# EAGLE design SIM-RELAY-2 (EAGLE 9.6.1)
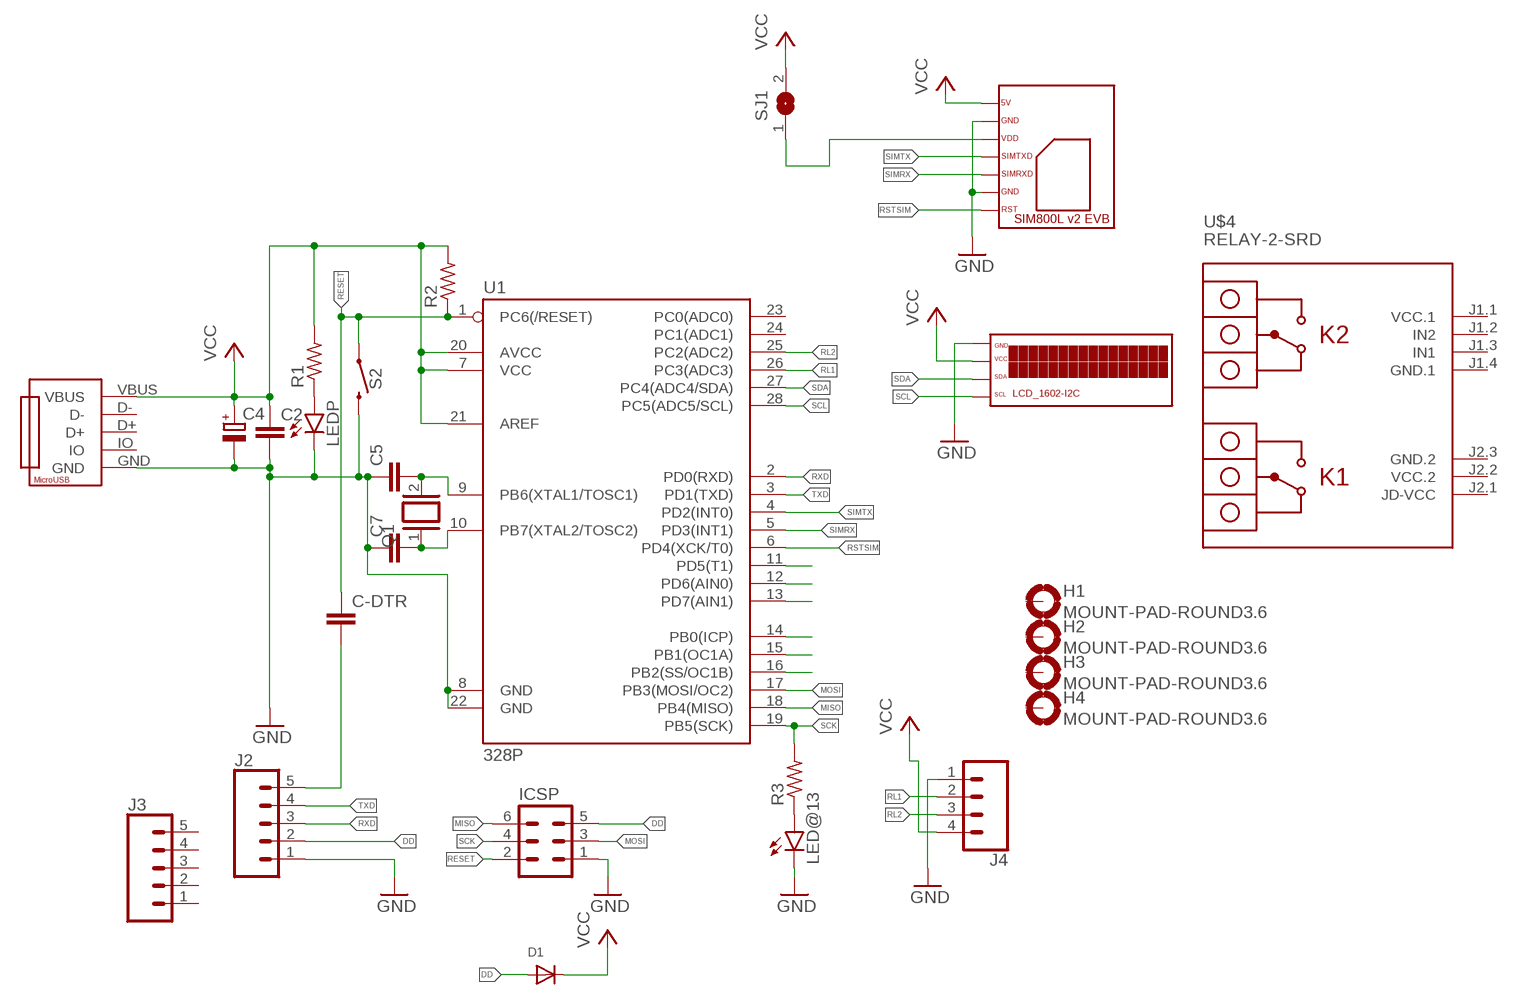
[diagram p0: schematic, sheet 1]

## Parts
C2  C-EU050-024X044  [C050-024X044]
C4  CPOL-EUB45181A  [B45181A]
C5  C-EU025-024X044  [C025-024X044]
C7  C-EU025-024X044  [C025-024X044]
C-DTR  C-EU050-024X044  [C050-024X044]
D1  DIODESMA  [SMADIODE]
H1  MOUNT-PAD-ROUND3.6  [3,6-PAD]
H2  MOUNT-PAD-ROUND3.6  [3,6-PAD]
H3  MOUNT-PAD-ROUND3.6  [3,6-PAD]
H4  MOUNT-PAD-ROUND3.6  [3,6-PAD]
ICSP  MA03-2  [MA03-2]
J2  CONN_05  [1X05]
J3  CONN_05  [1X05]
J4  CONN_04POLAR  [MOLEX-1X4]
LED@13  LED3MM  [LED3MM]
LEDP  LED3MM  [LED3MM]
Q1  XTAL/S  [QS]
R1  R-US_R0805  [R0805]
R2  R-US_R0805  [R0805]
R3  R-US_R0805  [R0805]
S2  MOMENTARY-SWITCH-SPST-SMD-6.0X3.5MM  [TACTILE_SWITCH_SMD_6.0X3.5MM]
SJ1  SJ  [SJ]
U1  328P  ATMEGA328P_PDIP  [DIP28]
U$1  LCD1602-I2C  [1602-I2C]
U$2  SIM800V2  [SIM800V2]
U$4  RELAY-2-SRD  [RELAY-2-SRD]
U$5  MICROUSB-CONVERTER  [MICROUSB-CONV-1]

## Nets
DD: D1.A ICSP.5 J2.2
GND [vcc]: C2.2 C4.- C5.1 C7.1 ICSP.1 J2.1 J4.1 LED@13.K(C) LEDP.K(C) S2.2 U1.8(GND) U1.22(GND) U$1.GND U$2.GND U$2.GND2 U$5.GND
MISO: ICSP.6 U1.18(PB4(MISO))
MOSI: ICSP.3 U1.17(PB3(MOSI/OC2))
N$1: LEDP.A R1.1
N$2: LED@13.A R3.1
N$3: C-DTR.2 J2.5
N$4: SJ1.1 U$2.VDD
N$8: U1.11(PD5(T1))
N$11: U1.12(PD6(AIN0))
N$12: U1.13(PD7(AIN1))
N$13: U1.14(PB0(ICP))
N$14: U1.15(PB1(OC1A))
N$15: U1.16(PB2(SS/OC1B))
N$21: C7.2 Q1.1 U1.10(PB7(XTAL2/TOSC2))
N$22: C5.2 Q1.2 U1.9(PB6(XTAL1/TOSC1))
RESET: C-DTR.1 ICSP.2 R2.1 S2.1 U1.1(PC6(/RESET))
RL1: J4.2 U1.26(PC3(ADC3))
RL2: J4.3 U1.25(PC2(ADC2))
RSTSIM: U1.6(PD4(XCK/T0)) U$2.RST
RXD: J2.3 U1.2(PD0(RXD))
SCK: ICSP.4 R3.2 U1.19(PB5(SCK))
SCL: U1.28(PC5(ADC5/SCL)) U$1.SCL
SDA: U1.27(PC4(ADC4/SDA)) U$1.SDA
SIMRX: U1.5(PD3(INT1)) U$2.SIMRXD
SIMTX: U1.4(PD2(INT0)) U$2.SIMTXD
TXD: J2.4 U1.3(PD1(TXD))
VCC: C2.1 C4.+ D1.C J4.4 R1.2 R2.2 SJ1.2 U1.7(VCC) U1.20(AVCC) U1.21(AREF) U$1.VCC U$2.5V U$5.VBUS
Unconnected: H1.B3,6(MOUNT) H2.B3,6(MOUNT) H3.B3,6(MOUNT) H4.B3,6(MOUNT) J3.1 J3.2 J3.3 J3.4 J3.5 U1.23(PC0(ADC0)) U1.24(PC1(ADC1)) U$4.J1.2(IN2) U$4.J1.3(IN1) U$4.J2.1(JD-VCC) U$5.D+ U$5.D- U$5.IO

## Power pins joined to a net without a drawn wire
GND.1: U$4.J1.4(GND.1)
GND.2: U$4.J2.3(GND.2)
VCC.1: U$4.J1.1(VCC.1)
VCC.2: U$4.J2.2(VCC.2)

## Library data of the parts
C2 C5 C7 C-DTR = rcl:C-EU: CAPACITOR, European symbol; SPICEPREFIX: C
C4 = rcl:CPOL-EU: POLARIZED CAPACITOR, European symbol; SPICEPREFIX: C
D1 = adafruit:DIODE: Diode SMADIODE - SMA Surface Mount Package 20V 1A Schottky Diode Digikey: 641-1014-6-ND DO-1N4148 - Through Hole Small Current Diode SOD-123 20V 1 A (.5mV Vf) Schottky Diode - Digikey: MBRX120TPMSCT-ND SOD-323 10V 570mA (.38mV Vf, 3ns) Schottky Diode - Digikey: ZLLS410CT-ND SOD-523 30V 30mA Schottky Diode (RB751S-40TE61) - Digikey: RB751S-40TE61CT-ND SOT23-R/W - SOT23 Package (R = Solder Paste/Reflow Ovens, W = Hand-Soldering) BAT54Film 40V 300mA - Digikey: 497-7162-1-ND
H1-H4 = holes:MOUNT-PAD-ROUND: MOUNTING PAD, round
ICSP = con-lstb:MA03-2: PIN HEADER; OC_FARNELL: unknown; OC_NEWARK: unknown
J2 J3 = SparkFun-Connectors:CONN_05: Multi connection point. Often used as Generic Header-pin footprint for 0.1 inch spaced/style header connections On any of the 0.1 inch spaced packages, you can populate with these: Break Away Headers - Straight <https://www.sparkfun.com/products/116> (PRT-00116) Break Away Male Headers - Right Angle <https://www.sparkfun.com/products/553> (PRT-00553) Female Headers <https://www.sparkfun.com/products/115> (PRT-00115) Break Away Headers - Machine Pin <https://www.sparkfun.com/products/117> (PRT-00117) Break Away Female Headers - Swiss Machine Pin <https://www.sparkfun.com/products/743> (PRT-00743) For SCREWTERMINALS and SPRING TERMINALS visit here: Screw Terimnals on SparkFun.com <https://www.sparkfun.com/search/results?term=Screw+Terminals> (5mm/3.5mm/2.54mm spacing) This device is also useful as a general connection point to wire up your design to another part of your project. Our various solder wires solder well into these plated through hole pads. Hook-Up Wire - Assortment (Stranded, 22 AWG) <https://www.sparkfun.com/products/11375> (PRT-11375) Hook-Up Wire - Assortment (Solid Core, 22 AWG) <https://www.sparkfun.com/products/11367> (PRT-11367) View the entire wire category on our website here <https://www.sparkfun.com/categories/141> Special notes: Molex polarized connector foot print use with SKU : PRT-08231 with associated crimp pins and housings. 1MM SMD Version SKU: PRT-10208
J4 = SparkFun-Connectors:CONN_04: Multi connection point. Often used as Generic Header-pin footprint for 0.1 inch spaced/style header connections On any of the 0.1 inch spaced packages, you can populate with these: Break Away Headers - Straight <https://www.sparkfun.com/products/116> (PRT-00116) Break Away Male Headers - Right Angle <https://www.sparkfun.com/products/553> (PRT-00553) Female Headers <https://www.sparkfun.com/products/115> (PRT-00115) Break Away Headers - Machine Pin <https://www.sparkfun.com/products/117> (PRT-00117) Break Away Female Headers - Swiss Machine Pin <https://www.sparkfun.com/products/743> (PRT-00743) For SCREWTERMINALS and SPRING TERMINALS visit here: Screw Terimnals on SparkFun.com <https://www.sparkfun.com/search/results?term=Screw+Terminals> (5mm/3.5mm/2.54mm spacing) This device is also useful as a general connection point to wire up your design to another part of your project. Our various solder wires solder well into these plated through hole pads. Hook-Up Wire - Assortment (Stranded, 22 AWG) <https://www.sparkfun.com/products/11375> (PRT-11375) Hook-Up Wire - Assortment (Solid Core, 22 AWG) <https://www.sparkfun.com/products/11367> (PRT-11367) View the entire wire category on our website here <https://www.sparkfun.com/categories/141> Special notes: Molex polarized connector foot print use with SKU : PRT-08231 with associated crimp pins and housings. 1MM SMD Version SKU: PRT-10208; PROD_ID: CONN-08186; SF_ID: PRT-08231
LED@13 LEDP = led:LED: LED OSRAM: - CHIPLED LG R971, LG N971, LY N971, LG Q971, LY Q971, LO R971, LY R971 LH N974, LH R974 LS Q976, LO Q976, LY Q976 LO Q996 - Hyper CHIPLED LW Q18S LB Q993, LB Q99A, LB R99A - SideLED LS A670, LO A670, LY A670, LG A670, LP A670 LB A673, LV A673, LT A673, LW A673 LH A674 LY A675 LS A676, LA A676, LO A676, LY A676, LW A676 LS A679, LY A679, LG A679 - Hyper Micro SIDELED® LS Y876, LA Y876, LO Y876, LY Y876 LT Y87S - SmartLED LW L88C, LW L88S LB L89C, LB L89S, LG L890 LS L89K, LO L89K, LY L89K LS L896, LA L896, LO L896, LY L896 - TOPLED LS T670, LO T670, LY T670, LG T670, LP T670 LSG T670, LSP T670, LSY T670, LOP T670, LYG T670 LG T671, LOG T671, LSG T671 LB T673, LV T673, LT T673, LW T673 LH T674 LS T676, LA T676, LO T676, LY T676, LB T676, LH T676, LSB T676, LW T676 LB T67C, LV T67C, LT T67C, LS T67K, LO T67K, LY T67K, LW E67C LS E67B, LA E67B, LO E67B, LY E67B, LB E67C, LV E67C, LT E67C LW T67C LS T679, LY T679, LG T679 LS T770, LO T770, LY T770, LG T770, LP T770 LB T773, LV T773, LT T773, LW T773 LH T774 LS E675, LA E675, LY E675, LS T675 LS T776, LA T776, LO T776, LY T776, LB T776 LHGB T686 LT T68C, LB T68C - Hyper Mini TOPLED® LB M676 - Mini TOPLED Santana® LG M470 LS M47K, LO M47K, LY M47K Source: http://www.osram.convergy.de LUXEON: - LUMILED® LXK2-PW12-R00, LXK2-PW12-S00, LXK2-PW14-U00, LXK2-PW14-V00 LXK2-PM12-R00, LXK2-PM12-S00, LXK2-PM14-U00 LXK2-PE12-Q00, LXK2-PE12-R00, LXK2-PE12-S00, LXK2-PE14-T00, LXK2-PE14-U00 LXK2-PB12-K00, LXK2-PB12-L00, LXK2-PB12-M00, LXK2-PB14-N00, LXK2-PB14-P00, LXK2-PB14-Q00 LXK2-PR12-L00, LXK2-PR12-M00, LXK2-PR14-Q00, LXK2-PR14-R00 LXK2-PD12-Q00, LXK2-PD12-R00, LXK2-PD12-S00 LXK2-PH12-R00, LXK2-PH12-S00 LXK2-PL12-P00, LXK2-PL12-Q00, LXK2-PL12-R00 Source: www.luxeon.com KINGBRIGHT: KA-3528ASYC Source: www.kingbright.com
Q1 = special:XTAL/S: CRYSTAL
R1-R3 = rcl:R-US_: RESISTOR, American symbol; SPICEPREFIX: R
S2 = SparkFun-Switches:MOMENTARY-SWITCH-SPST: Momentary Switch (Pushbutton) - SPST Normally-open (NO) SPST momentary switches (buttons, pushbuttons). Variants PTH-12MM - 12mm square, through-hole Momentary Pushbutton Switch - 12mm Square <https://www.sparkfun.com/products/9190> (COM-09190) PTH-6.0MM, PTH-6.0MM-KIT - 6.0mm square, through-hole Mini Pushbutton Switch <https://www.sparkfun.com/products/97> (COM-00097) KIT package intended for soldering kit's - only one side of pads' copper is exposed. PTH-RIGHT-ANGLE-KIT - Right-angle, through-hole Right Angle Tactile Button <https://www.sparkfun.com/products/10791> - Used on SparkFun BigTime Watch Kit <https://www.sparkfun.com/products/11734> SMD-12MM - 12mm square, surface-mount Tactile Button - SMD (12mm) <https://www.sparkfun.com/products/12993> (COM-12993) Used on SparkFun PicoBoard <https://www.sparkfun.com/products/11888> SMD-4.5MM - 4.5mm Square Trackball Switch Used on SparkFun Blackberry Trackballer Breakout <https://www.sparkfun.com/products/13169> SMD-4.6MMX2.8MM - 4.60mm x 2.80mm, surface mount Used on SparkFun SAMD21 Mini Breakout <https://www.sparkfun.com/products/13664> SMD-5.2MM, SMD-5.2-REDUNDANT - 5.2mm square, surface-mount Mini Pushbutton Switch - SMD <https://www.sparkfun.com/products/8720> (COM-08720) Used on Arduino Pro Mini <https://www.sparkfun.com/products/11114> REDUNDANT package connects both switch circuits together SMD-6.0X3.5MM - 6.0 x 3.5mm, surface mount Momentary Reset Switch SMD <https://www.sparkfun.com/products/8229> (COM-08229) SMD-6.2MM-TALL - 6.2mm square, surface mount Tactile Button - SMD (6mm) <https://www.sparkfun.com/products/12992> Used on SparkFun Digital Sandbox <https://www.sparkfun.com/products/12651> SMD-RIGHT-ANGLE - Right-angle, surface mount Used on SparkFun Block for Intel® Edison - Arduino <https://www.sparkfun.com/products/13036>; PROD_ID: SWCH-00815; SF_SKU: COM-08229
SJ1 = jumper:SJ: SMD solder JUMPER
U1 = SparkFun-IC-Microcontroller:ATMEGA328P_PDIP: Atmel 328P Through hole ATMEGA328P uC used in the Arduino 32kb flash, 1k EEPROM, 2k SRAM Datasheet <http://www.sparkfun.com/datasheets/Components/SMD/ATMega328.pdf> SparkFun Products Storefront component: AVR 28 Pin 20MHz 32K 6A/D - ATMega328P <https://www.sparkfun.com/products/9061> (COM-09061) SparkFun Simon Says - Through-Hole Soldering Kit <https://www.sparkfun.com/products/10547> (KIT-10547) SparkFun Learn to Solder - Simon Says <https://www.sparkfun.com/products/13708> (KIT-13708) SparkFun BigTime Watch Kit <https://www.sparkfun.com/products/11734> (KIT-11734) SparkFun ClockIt <https://www.sparkfun.com/products/10930> (KIT-10930) SparkFun Serial Enabled LCD Kit <https://www.sparkfun.com/products/10097> (LCD-10097) SparkFun Simon Tilts - Through Hole Soldering Kit <https://www.sparkfun.com/products/12634> (KIT-12634) SparkFun Frequency Counter Kit <https://www.sparkfun.com/products/10140> (KIT-10140) FabFM Radio Kit <https://www.sparkfun.com/products/11043> (KIT-11043) SparkFun Binary Blaster Kit <https://www.sparkfun.com/products/12037> (KIT-12037) SparkFun Metro-Gnome <https://www.sparkfun.com/products/9236> (KIT-09236) ATmega328 with Arduino Optiboot (Uno) <https://www.sparkfun.com/products/10524> (DEV-10524); PROD_ID: IC-09136
U$1 = IBe-9102-lib:LCD1602-I2C
U$2 = IBe-9102-lib:SIM800V2
U$4 = diy-modules:RELAY-2-SRD: 2-Channel Relay Module based on SRD-05VDC-SL-C relays Click here to find device on ebay.com <http://www.ebay.com/sch/two+channel+relay+module+optocoupler+5v>
U$5 = IBe-9102-lib:MICROUSB-CONVERTER

## Net classes
1 vcc: width 0.254 mm

## Board
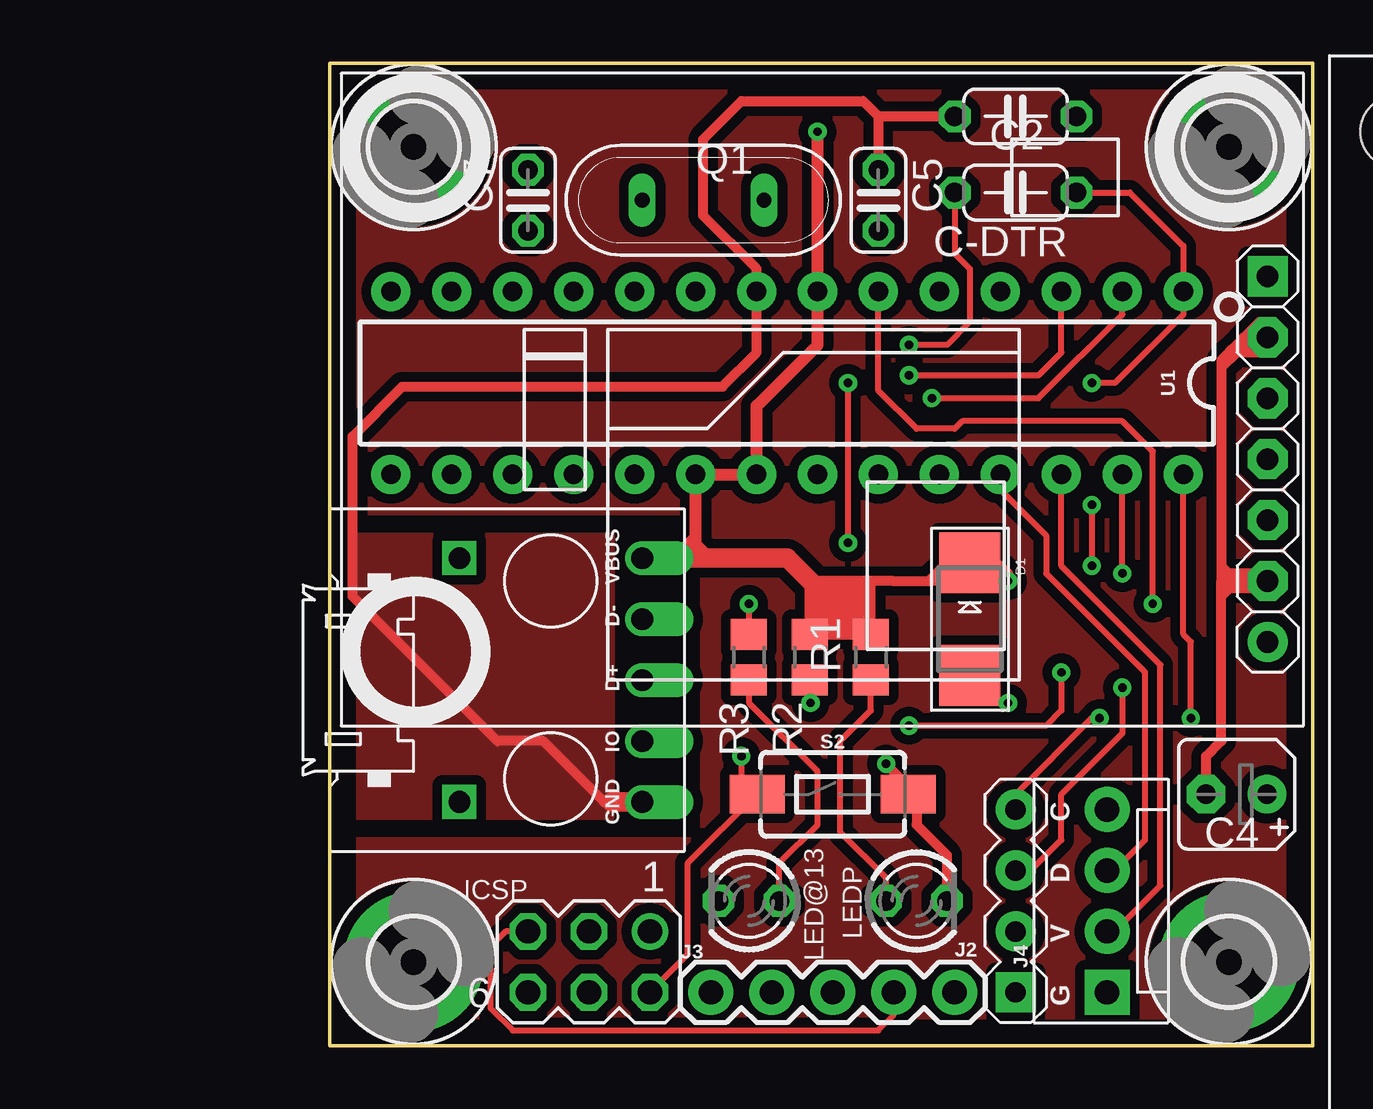
[diagram p1: board, top side]
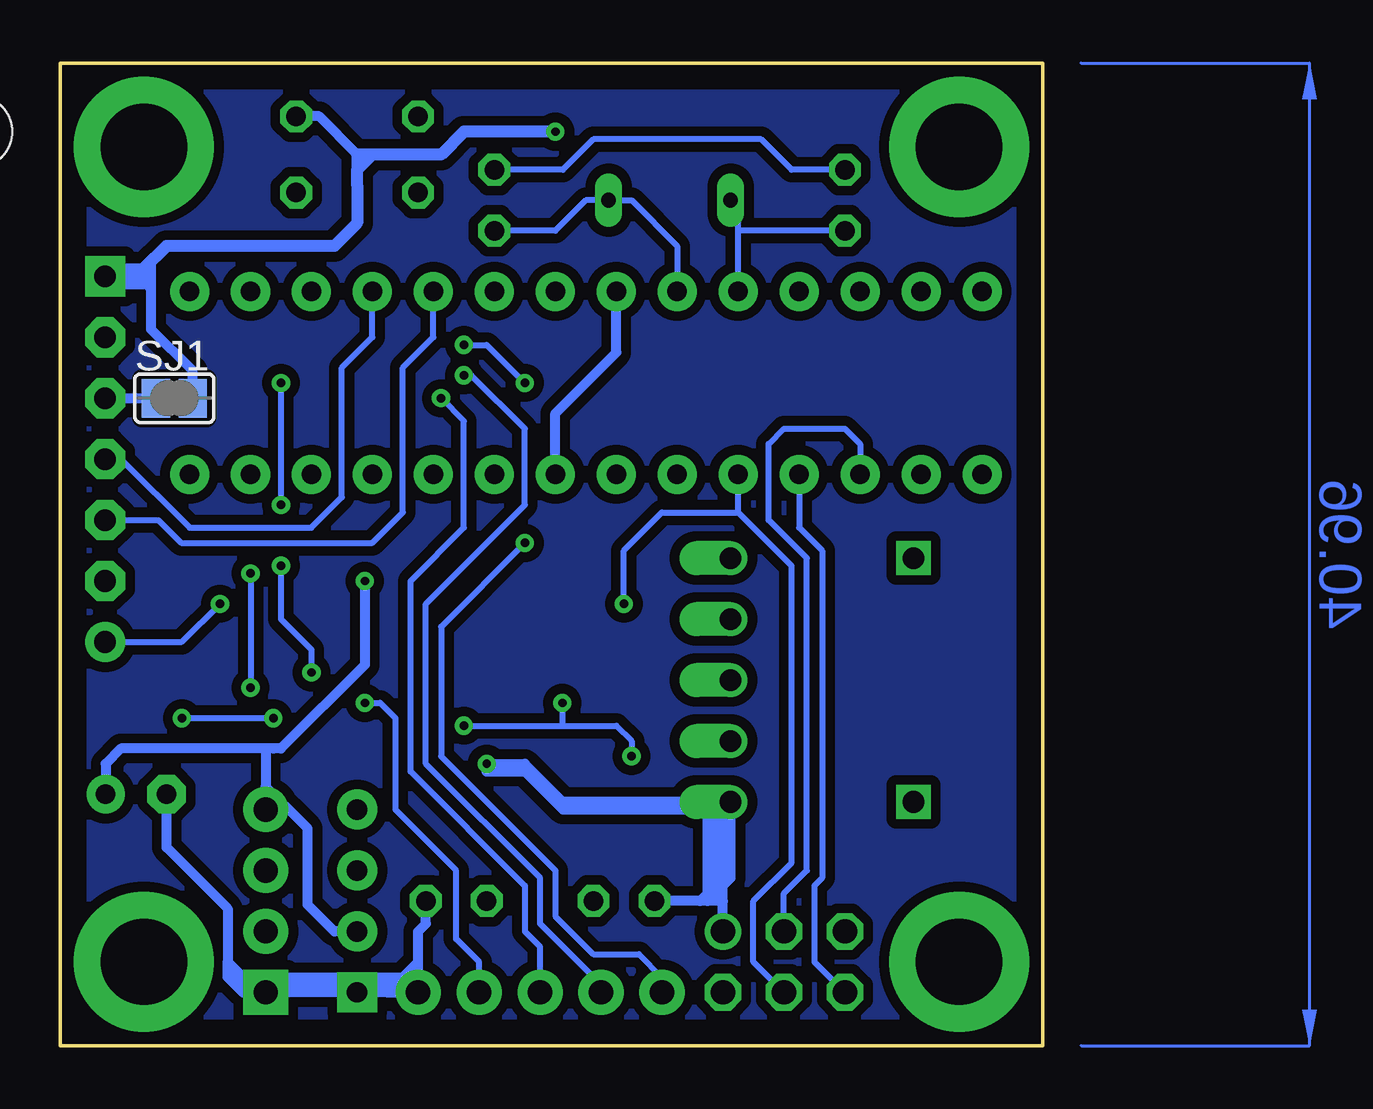
[diagram p2: board, bottom side, seen from below]

Size 40.96 x 40.96 mm. Coordinates in mm from the lower left corner, seen from the top.
Outline: 0,0 40.96,0 40.96,40.96 0,40.96 0,0
Copper layers (1*16): Top 0.035mm / dielectric 1.5mm / Bottom 0.035mm
Design rules "default": minimum track width 6mil, minimum drill 0.35mm, track to track 6mil, track to pad 6mil, pad to pad 6mil, via to via 6mil, smd to smd 6mil, copper to edge 40mil, drill to drill 6mil, minimum pad ring 10mil, minimum via ring 8mil, stop-mask expansion 4mil, vias tented up to drill 0mil, thermal gap 10mil

### Footprints (pad centres in the part's own frame; a part is rotated, then mirrored left to right if it is on the bottom)
C050-024X044 = drill 0.813 octagon: 1 -2.54,0; 2 2.54,0
B45181A = drill 0.813 pad 1.6: + -1.27,0 | drill 0.813 pad 1.6 octagon: - 1.27,0
C025-024X044 = drill 0.813 octagon: 1 -1.27,0; 2 1.27,0
SMADIODE = smd 2.54 x 2.54: A 2.349,0; C -2.349,0
3,6-PAD = drill 3.6 pad 5.842: B3,6 0,0
MA03-2 = drill 1.016: 1 -2.54,-1.27 | drill 1.016 octagon: 2 -2.54,1.27; 3 0,-1.27; 4 0,1.27; 5 2.54,-1.27; 6 2.54,1.27
1X05 = drill 1.016 pad 1.88: 1 0,0; 2 2.54,0; 3 5.08,0; 4 7.62,0; 5 10.16,0
MOLEX-1X4 = drill 1.016 pad 1.88 square: 1 0,0 | drill 1.016 pad 1.88: 2 2.54,0; 3 5.08,0; 4 7.62,0
LED3MM = drill 0.813 octagon: A -1.27,0; K 1.27,0
QS = drill 0.61 long: 1 -2.54,0; 2 2.54,0
R0805 = smd 1.3 x 1.5: 1 -0.95,0; 2 0.95,0
TACTILE_SWITCH_SMD_6.0X3.5MM = smd 2.3 x 1.6: 1 -3.15,0; 2 3.15,0
SJ = smd 1.168 x 1.6: 1 -0.762,0; 2 0.762,0
DIP28 = drill 0.813 pad 1.626: 1 -16.51,-3.81; 2 -13.97,-3.81; 3 -11.43,-3.81; 4 -8.89,-3.81; 5 -6.35,-3.81; 6 -3.81,-3.81; 7 -1.27,-3.81; 8 1.27,-3.81; 9 3.81,-3.81; 10 6.35,-3.81; 11 8.89,-3.81; 12 11.43,-3.81; 13 13.97,-3.81; 14 16.51,-3.81; 15 16.51,3.81; 16 13.97,3.81; 17 11.43,3.81; 18 8.89,3.81; 19 6.35,3.81; 20 3.81,3.81; 21 1.27,3.81; 22 -1.27,3.81; 23 -3.81,3.81; 24 -6.35,3.81; 25 -8.89,3.81; 26 -11.43,3.81; 27 -13.97,3.81; 28 -16.51,3.81
1602-I2C = drill 0.85 pad 1.676 square: GND 0,3.81 | drill 0.85 pad 1.676: SCL 0,-3.81; SDA 0,-1.27; VCC 0,1.27
SIM800V2 = drill 0.9 pad 1.676 square: 5V 18.28,7.303 | drill 0.9 pad 1.676 octagon: GND 18.28,4.763; GND2 18.28,-5.397; SIMRXD 18.28,-2.857; SIMTXD 18.28,-0.318; VDD 18.28,2.223 | drill 0.9 pad 1.676: RST 18.28,-7.938
RELAY-2-SRD = drill 1 square: J1.1 21.59,11.43; J2.1 21.59,-11.43 | drill 1: J1.2 21.59,8.89; J1.3 21.59,6.35; J1.4 21.59,3.81; J2.2 21.59,-8.89; J2.3 21.59,-6.35 | hole 3: -22.225,16.51; 22.225,16.51; 22.225,-16.51; -22.225,-16.51
MICROUSB-CONV-1 = drill 0.9 pad 1.422 offset: D+ 6.35,0; D- 6.35,2.54; GND 6.35,-5.08; IO 6.35,-2.54; VBUS 6.35,5.08 | drill 0.9 pad 1.422 square: P$6 -1.27,-5.08; P$7 -1.27,5.08

### Placement (x,y rotation side)
C2  28.57,38.73 180 top
C4  37.78,10.48 180 top
C5  22.86,35.24 270 top
C7  8.25,35.24 270 top
C-DTR  28.57,35.56 180 top
D1  26.67,17.78 270 top
H1  37.47,3.49 0 top
H2  3.49,3.49 0 top
H3  37.47,37.47 0 top
H4  3.49,37.47 0 top
ICSP  10.79,3.49 180 top
J2  26.04,2.22 180 top
J3  15.87,2.22 0 top
J4  32.39,2.22 90 top
LED@13  17.46,6.03 180 top
LEDP  24.45,6.03 0 top
Q1  15.56,35.24 0 top
R1  22.54,16.19 90 top
R2  20,16.19 90 top
R3  17.46,16.19 90 top
S2  20.96,10.48 0 top
SJ1  36.19,26.99 0 bottom
U1  19.05,27.62 180 top
U$1  28.57,6.03 180 top
U$2  20.8,24.76 0 top
U$4  60.96,15.88 270 top  (outside the outline)
U$5  6.67,15.24 0 top

### Tracks (layer width: path | path; a pad name or v marks a point on that pad's centre or on a via)
DD  (via drill 0.35)
  Top 0.254: ICSP.5 7.33,4.76 6.69,4.13 6.69,1.56 7.62,0.63 22.86,0.63 23.5,1.27 J2.2 | v28.26,14.29 27.81,14.29 D1.A
  Bottom 0.254: J2.2 23.5,3.49 24.45,4.45 24.45,7.3 26.99,9.84 26.99,13.65 27.62,14.29 v28.26,14.29
FB
  pour Bottom (isolate 0.406): 0.32,40.64 40.64,40.64 40.64,0.32 0.32,0.32
FT
  pour Top (isolate 0.406): 0.32,40.64 40.64,40.64 40.64,0.32 0.32,0.32 0.32,8.57 15.56,8.57 15.56,22.22 0.32,22.22
GND  (via drill 0.35)
  Top 0.254: 24.28,10.97 24.45,11.14 | 17.78,28.89 U1.8 17.78,32.39 | S2.2 23.8,10.78 23.8,11.1
  Top 0.406: LEDP.K 25.72,7.94 24.45,9.21 24.45,10.14 S2.2 24.28,10.65 24.28,10.97 | v23.18,11.75 23.18,11.72 23.8,11.1 | 11.75,10.16 11.43,10.16 8.89,12.7 6.98,12.7 0.95,18.73 0.95,25.4 3.02,27.46 16.35,27.46 17.78,28.89 17.78,32.39 15.56,34.61 15.56,37.78 17.14,39.37 22.22,39.37 22.86,38.74 | 22.86,38.74 C5.1 | 22.86,38.74 C2.2 | U$2.GND 38.1,29.53 | 38.1,29.53 37.78,29.21 | 37.47,28.89 37.15,28.57 37.15,28.26 | 37.15,28.26 37.15,20 | 37.15,20 37.15,19.37 | U$2.GND2 39.05,19.37 | 39.05,19.37 37.78,19.37 | 37.47,19.37 37.15,19.37 | C4.- 36.51,12.07 37.15,12.7 37.15,18.73 | 37.15,18.73 37.15,19.05 | 37.15,19.05 37.15,19.37 | 38.42,29.85 38.73,30.16 39.05,30.16 39.05,29.21 | 39.05,29.21 39.05,28.89 37.78,28.89 | 37.78,28.89 37.47,28.89 | 37.47,28.89 37.78,29.21 | 37.78,29.21 39.05,29.21 | 39.05,29.21 38.73,29.53 38.73,29.85 38.42,29.85 | 38.42,29.85 38.1,29.53 | 37.15,28.26 37.78,28.89 | 37.15,19.05 37.47,19.37 | 37.47,19.37 37.47,19.68 | 37.47,19.68 37.15,20 | 37.47,19.68 37.78,19.37 | 37.78,19.37 37.15,18.73 | 37.47,19.37 37.78,19.37 | 39.05,19.37 39.05,19.68 | 39.05,19.68 37.47,19.68 | 39.05,19.68 39.37,19.68 39.37,19.05 37.15,19.05
  Top 0.813: U$5.GND 11.75,10.16
  Bottom 0.254: J4.1 U$1.GND 27.3,2.22 | C7.1 10.48,36.51 11.75,37.78 18.73,37.78 20,36.51 C5.1
  Bottom 0.406: 26.67,2.22 J2.1 26.04,2.86 | 27.3,2.22 J4.1 33.34,2.22 33.66,2.54 | 33.97,2.86 33.97,3.49 | C4.- 36.51,8.25 33.97,5.71 33.97,3.49 | 26.04,2.86 26.04,3.18 | 26.04,3.18 26.04,3.49 | 26.04,3.49 26.04,4.76 25.72,5.08 LEDP.K | 13.33,10.16 U$5.GND 13.02,6.98 13.33,6.67 | 13.33,10.16 13.97,10.16 | 13.97,10.16 20,10.16 21.59,11.75 v23.18,11.75 23.18,11.43 21.59,11.43 20,9.84 13.97,9.84 | ICSP.1 13.33,6.03 | 13.33,6.03 13.33,6.67 | 13.33,6.03 13.97,6.03 | 13.97,6.03 14.29,6.03 | 14.29,6.03 LED@13.K | U1.22 20.32,26.35 17.78,28.89 U1.8 | 26.04,3.49 27.3,2.22 | 27.3,2.22 26.99,2.22 | 26.04,2.86 26.35,2.54 | 26.35,2.54 26.67,2.22 | 26.67,2.22 26.99,2.22 | 26.99,2.22 26.35,2.86 | 26.35,2.86 26.04,3.18 | 26.35,2.54 33.02,2.54 | 33.02,2.54 33.66,2.54 | 33.66,2.54 33.97,2.86 | 33.97,2.86 26.35,2.86 | 13.97,6.03 13.33,6.67 | 13.33,6.67 13.33,10.16 | 13.33,10.16 13.65,9.84 13.65,6.67 13.97,6.35 | 14.29,6.03 13.97,6.35 | 13.97,6.35 13.97,9.84 | 13.97,9.84 13.97,10.16 | 33.02,2.54 33.97,3.49
  pour Top (isolate 0.406): 0.32,21.27 11.75,21.27 11.75,9.52 0.32,9.52
MISO
  Bottom 0.254: U1.18 10.16,21.59 9.21,20.64 9.21,6.98 9.53,6.67 9.53,3.49 ICSP.6
MOSI
  Bottom 0.254: ICSP.3 10.79,6.35 9.84,7.3 9.84,20.32 11.43,21.91 11.43,25.08 10.79,25.72 8.25,25.72 7.62,25.08 U1.17
N$1
  Top 0.254: LEDP.A 23.18,6.98 21.27,8.89 21.27,12.7 22.54,13.97 R1.1
N$2
  Top 0.254: 17.46,14.92 R3.1 17.46,14.29 20.32,11.43 20.32,9.21 18.73,7.62 LED@13.A
N$3  (via drill 0.35)
  Top 0.254: C-DTR.2 26.04,33.02 26.67,32.39 26.67,30.16 25.72,29.21 v24.13,29.21 | v21.59,27.62 v21.59,20.96
  Bottom 0.254: v21.59,27.62 23.18,29.21 v24.13,29.21 | v21.59,20.96 25.08,17.46 25.08,12.07 20.32,7.3 20.32,5.4 18.73,3.81 16.83,3.81 15.87,2.86 J2.5
N$4
  Bottom 0.406: U$2.VDD SJ1.1
N$21
  Bottom 0.254: U1.10 12.7,33.97 | 12.7,33.97 12.7,34.93 Q1.1 | C7.2 12.7,33.97
N$22
  Bottom 0.254: U1.9 15.24,33.34 17.14,35.24 Q1.2 19.05,35.24 20.32,33.97 C5.2
RESET  (via drill 0.35)
  Top 0.254: ICSP.2 14.92,3.81 14.92,7.62 17.78,10.48 S2.1 | C-DTR.1 33.34,35.56 35.56,33.34 U1.1 35.56,30.48 32.7,27.62 v31.75,27.62 | S2.1 17.8,10.8 | R2.1 20,14.31 v20.03,14.29 | S2.1 17.14,10.48 v17.14,12.07 | v31.75,22.54 v31.75,20 | v30.48,15.56 30.48,13.97 29.85,13.34 v24.13,13.34
  Bottom 0.254: v20.03,14.29 20.03,13.34 | 20.03,13.34 17.78,13.34 17.14,12.7 v17.14,12.07 | v31.75,27.62 v31.75,22.54 | v31.75,20 31.75,17.78 30.48,16.51 v30.48,15.56 | v24.13,13.34 20.03,13.34
RL1
  Top 0.254: J4.2 32.7,4.76 34.61,6.67 34.61,15.87 30.48,20 U1.26
RL2
  Top 0.254: J4.3 32.7,7.3 33.97,8.57 33.97,15.56 29.85,19.68 29.85,21.27 27.94,23.18 U1.25
RSTSIM  (via drill 0.35)
  Top 0.254: U1.6 22.86,27.31 24.45,25.72 26.04,25.72 26.35,26.04 33.02,26.04 34.29,24.76 v34.29,18.42
  Bottom 0.254: U$2.RST 35.88,16.83 v34.29,18.42
RXD  (via drill 0.35)
  Top 0.254: v25.08,26.99 29.53,26.99 33.02,30.48 U1.2
  Bottom 0.254: J2.3 20.96,4.13 21.59,4.76 21.59,6.67 26.35,11.43 26.35,19.37 24.13,21.59 24.13,26.04 v25.08,26.99
SCK  (via drill 0.35)
  Top 0.254: v17.46,18.42 R3.2
  Bottom 0.254: 12.7,22.22 10.48,20 10.48,7.62 12.07,6.03 12.07,3.49 ICSP.4 | 12.7,22.22 U1.19 | v17.46,18.42 17.46,20.64 15.87,22.22 12.7,22.22
SCL  (via drill 0.35)
  Top 0.254: U1.28 35.56,17.14 35.88,16.83 v35.88,13.65 | v32.07,13.65 31.75,13.65 28.57,10.48 U$1.SCL
  Bottom 0.254: v35.88,13.65 v32.07,13.65
SDA  (via drill 0.35)
  Top 0.254: U$1.SDA 29.21,7.3 30.48,8.57 30.48,10.48 33.02,13.02 v33.02,14.92 | v33.02,19.68 U1.27
  Bottom 0.254: v33.02,19.68 v33.02,14.92
SIMRX
  Bottom 0.254: U$2.SIMRXD 36.85,21.91 35.9,20.96 27.94,20.96 26.67,22.22 26.67,28.26 25.4,29.53 U1.5
SIMTX
  Bottom 0.254: U$2.SIMTXD 38.42,24.45 35.56,21.59 30.48,21.59 29.21,22.86 29.21,28.26 27.94,29.53 U1.4
TXD  (via drill 0.35)
  Top 0.254: U1.3 30.48,28.89 29.53,27.94 v24.13,27.94
  Bottom 0.254: J2.4 18.41,2.54 20.96,5.08 20.96,6.98 25.72,11.75 25.72,18.42 21.59,22.54 21.59,25.72 23.81,27.94 v24.13,27.94
VCC  (via drill 0.35)
  Top 0.254: 23.5,19.37 26.04,19.37 26.42,19.37 | D1.C 26.42,20.38 26.42,19.37 | 26.99,19.37 26.42,19.37
  Top 0.406: 22.54,19.37 23.5,19.37 24.96,19.37 | 22.54,19.37 20,19.37 | 24.96,19.37 25.72,20.13 D1.C 27.18,20.13 27.3,20 27.94,20 | 26.04,19.37 24.96,19.37 | 22.54,19.37 R1.2 R2.2 20,19.37 | v28.26,19.37 26.99,19.37 | v28.26,19.37 27.94,19.68 27.94,20 | v28.26,19.37 28.26,19.68 27.94,20 | U$5.VBUS 14.29,20.32 | 14.29,20.32 15.24,20.32 | 15.87,20.32 18.73,20.32 | 19.05,20.32 20,19.37 | 15.24,20.32 15.24,20.96 | 15.24,21.27 U1.20 | 14.29,20.32 15.24,21.27 | 15.24,21.27 15.24,20.96 | 15.24,20.96 14.92,20.64 15.24,20.32 | 15.24,20.32 15.56,20.32 15.87,20.32 | 15.87,20.32 15.24,20.96
  Top 0.508: 15.24,20.96 U1.20 U1.21 17.78,26.67 20.32,29.21 U1.7 v20.32,38.1
  Top 0.813: U$5.VBUS 15.56,20.32 18.73,20.32 19.05,20.32 20.32,19.05 21.27,19.05
  Bottom 0.254: 37.15,29.85 37.15,31.43 | 37.15,32.7 37.15,32.07 | 37.15,32.07 37.15,31.75 | 37.15,31.75 37.15,31.43 | 38.42,12.38 32.39,12.38 32.07,12.38 | 37.48,32.4 37.64,32.24 37.81,32.07 37.78,32.07 37.47,31.75 | 37.32,32.56 37.48,32.4 | 37.32,32.56 37.16,32.71 36.54,33.34 | 37.15,31.43 37.47,31.75 | 37.47,32.07 37.15,32.07 | 37.32,32.56 37.32,31.92 37.15,31.75 | 37.47,31.75 37.47,32.07 | 37.47,32.07 37.47,32.39 37.48,32.4
  Bottom 0.406: v28.26,19.37 28.26,15.87 31.75,12.38 32.07,12.38 38.42,12.38 39.05,11.75 C4.+ | 32.39,12.38 32.39,10.8 | U$1.VCC 29.53,4.76 30.64,5.87 30.64,9.05 31.43,9.84 | J4.4 31.43,9.84 | 28.57,37.15 30.16,38.74 C2.1 | SJ1.2 35.43,28.13 37.15,29.85 37.16,29.86 37.16,32.71 | U$2.5V 39.05,32.07 | 39.05,32.07 37.81,32.07 | 37.64,32.24 36.54,33.34 29.53,33.34 | 37.48,32.4 37.81,32.07 | 31.43,9.84 31.75,10.16 | 31.75,10.16 32.39,10.8 | 32.39,10.8 J4.4 | J4.4 32.07,10.16 31.75,10.16 | 37.47,32.07 37.81,32.07 | 39.05,32.07 39.05,31.75 | 39.05,31.75 37.47,31.75 37.47,32.39 39.05,32.39 | 39.05,32.39 39.05,32.07 | 39.05,31.75 39.37,31.75 39.37,32.39 39.05,32.39
  Bottom 0.508: v20.32,38.1 24.13,38.1 25.08,37.15 27.94,37.15 | 27.94,37.15 28.57,37.15 28.57,36.51 | 39.05,32.07 37.78,32.07 37.47,32.39 36.51,33.34 29.53,33.34 28.57,34.29 28.57,35.88 28.57,36.51 | 28.57,36.51 27.94,37.15
(copper drawn outside any net)
  shapes: Bottom area x2, Top area x1